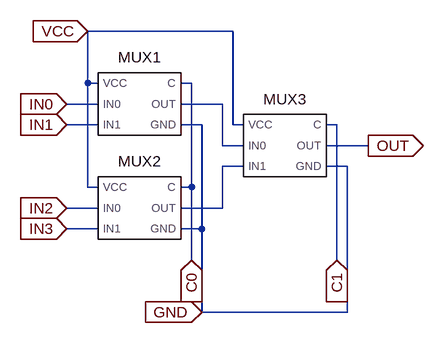
[diagram p0: schematic mux_4to1.asc]
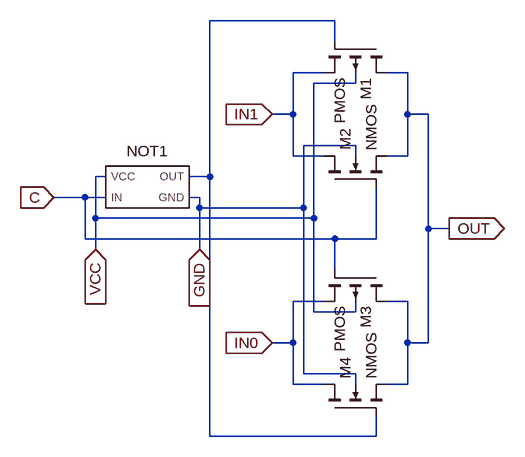
[diagram p1: sub-circuit mux_2to1.asc]
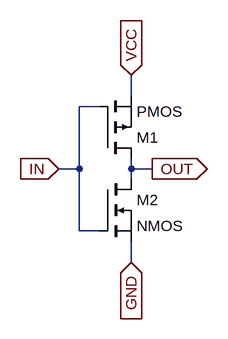
[diagram p2: sub-circuit not.asc]
mux_4to1.asc, the LTspice schematic file:
Version 4.1
SHEET 1 880 680
WIRE 336 32 112 32
WIRE 112 112 112 32
WIRE 128 112 112 112
WIRE 272 112 256 112
WIRE 128 144 80 144
WIRE 320 144 256 144
WIRE 128 176 80 176
WIRE 288 176 256 176
WIRE 336 176 336 32
WIRE 352 176 336 176
WIRE 496 176 480 176
WIRE 320 208 320 144
WIRE 352 208 320 208
WIRE 544 208 480 208
WIRE 352 240 320 240
WIRE 512 240 480 240
WIRE 112 272 112 112
WIRE 128 272 112 272
WIRE 272 272 272 112
WIRE 272 272 256 272
WIRE 128 304 80 304
WIRE 320 304 320 240
WIRE 320 304 256 304
WIRE 128 336 80 336
WIRE 288 336 288 176
WIRE 288 336 256 336
WIRE 272 384 272 272
WIRE 496 384 496 176
WIRE 288 464 288 336
WIRE 512 464 512 240
WIRE 512 464 288 464
FLAG 112 32 VCC
IOPIN 112 32 In
FLAG 288 464 GND
IOPIN 288 464 In
FLAG 272 384 C0
IOPIN 272 384 In
FLAG 496 384 C1
IOPIN 496 384 In
FLAG 544 208 OUT
IOPIN 544 208 Out
FLAG 80 336 IN3
IOPIN 80 336 In
FLAG 80 304 IN2
IOPIN 80 304 In
FLAG 80 176 IN1
IOPIN 80 176 In
FLAG 80 144 IN0
IOPIN 80 144 In
SYMBOL mux_2to1 192 144 R0
SYMATTR InstName MUX1
SYMBOL mux_2to1 192 304 R0
SYMATTR InstName MUX2
SYMBOL mux_2to1 416 208 R0
SYMATTR InstName MUX3

mux_2to1.asc, the sub-circuit schematic file:
Version 4.1
SHEET 1 880 696
WIRE 192 48 0 48
WIRE 192 80 192 48
WIRE 176 128 128 128
WIRE 304 128 272 128
WIRE 224 144 224 128
WIRE 224 144 160 144
WIRE 128 192 128 128
WIRE 128 192 96 192
WIRE 304 192 304 128
WIRE 336 192 304 192
WIRE 224 240 144 240
WIRE 128 256 128 192
WIRE 176 256 128 256
WIRE 224 256 224 240
WIRE 304 256 304 192
WIRE 304 256 272 256
WIRE -160 288 -176 288
WIRE 0 288 0 48
WIRE 0 288 -32 288
WIRE -192 320 -240 320
WIRE -160 320 -192 320
WIRE -16 320 -32 320
WIRE -16 336 -16 320
WIRE 144 336 144 240
WIRE 144 336 -16 336
WIRE -176 352 -176 288
WIRE 160 352 160 144
WIRE 160 352 -176 352
WIRE 336 368 336 192
WIRE 368 368 336 368
WIRE -192 384 -192 320
WIRE 192 384 -192 384
WIRE 256 384 256 304
WIRE 256 384 192 384
WIRE -176 400 -176 352
WIRE -16 400 -16 336
WIRE 192 432 192 384
WIRE 176 480 128 480
WIRE 304 480 272 480
WIRE 160 496 160 352
WIRE 224 496 224 480
WIRE 224 496 160 496
WIRE 128 544 128 480
WIRE 128 544 96 544
WIRE 304 544 304 480
WIRE 336 544 336 368
WIRE 336 544 304 544
WIRE 144 592 144 336
WIRE 224 592 144 592
WIRE 128 608 128 544
WIRE 176 608 128 608
WIRE 224 608 224 592
WIRE 304 608 304 544
WIRE 304 608 272 608
WIRE 0 688 0 288
WIRE 256 688 256 656
WIRE 256 688 0 688
FLAG 368 368 OUT
IOPIN 368 368 Out
FLAG 96 192 IN1
IOPIN 96 192 In
FLAG 96 544 IN0
IOPIN 96 544 In
FLAG -240 320 C
IOPIN -240 320 In
FLAG -176 400 VCC
IOPIN -176 400 In
FLAG -16 400 GND
IOPIN -16 400 In
SYMBOL not -96 304 R0
SYMATTR InstName NOT1
SYMBOL pmos4 272 80 R90
SYMATTR InstName M1
SYMBOL pmos4 272 432 R90
SYMATTR InstName M3
SYMBOL nmos4 176 304 R270
SYMATTR InstName M2
SYMBOL nmos4 176 656 R270
SYMATTR InstName M4

not.asc, the sub-circuit schematic file:
Version 4.1
SHEET 1 880 680
WIRE 176 48 176 16
WIRE 128 64 96 64
WIRE 96 160 96 64
WIRE 96 160 64 160
WIRE 176 160 176 144
WIRE 208 160 176 160
WIRE 176 176 176 160
WIRE 96 256 96 160
WIRE 128 256 96 256
WIRE 176 304 176 272
FLAG 64 160 IN
IOPIN 64 160 In
FLAG 208 160 OUT
IOPIN 208 160 Out
FLAG 176 16 VCC
IOPIN 176 16 In
FLAG 176 304 GND
IOPIN 176 304 In
SYMBOL pmos 128 144 M180
SYMATTR InstName M1
SYMBOL nmos 128 176 R0
SYMATTR InstName M2

The netlist it stands for:
* mux_4to1.asc
X§MUX1 C0 GND IN0 IN1 VCC N001 mux_2to1
X§MUX2 C0 GND IN2 IN3 VCC N002 mux_2to1
X§MUX3 C1 GND N001 N002 VCC OUT mux_2to1

* block symbol definitions
.subckt mux_2to1 C GND IN0 IN1 VCC OUT
X§NOT1 GND C VCC N001 not
M1 OUT N001 IN1 VCC PMOS
M3 OUT C IN0 VCC PMOS
M2 IN1 C OUT GND NMOS
M4 IN0 N001 OUT GND NMOS
.ends mux_2to1

.subckt not GND IN VCC OUT
M1 OUT IN VCC VCC PMOS
M2 OUT IN GND GND NMOS
.ends not

.model NMOS NMOS
.model PMOS PMOS
.lib standard.mos
.backanno
.end